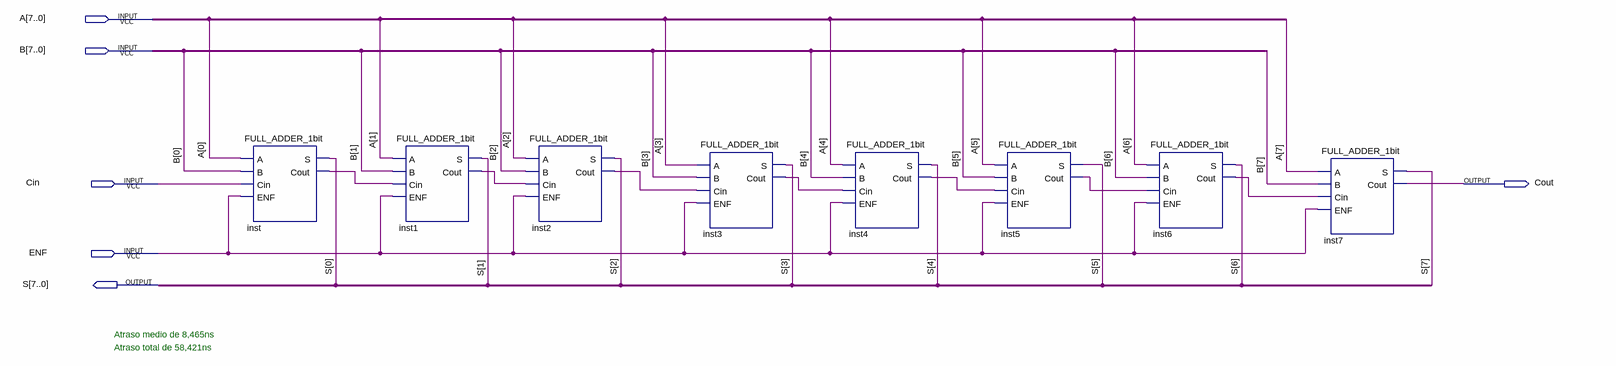
[diagram p0: schematic sheet]
// Quartus schematic FULL_ADDER_8bit.bdf as structural Verilog: 8 symbols, 6 pins
module FULL_ADDER_8bit (
  input  [7:0] A,
  input  [7:0] B,
  input  Cin,
  input  ENF,
  output Cout,
  output [7:0] S
);

  wire inst1_cout, inst2_cout, inst3_cout, inst4_cout, inst5_cout, inst6_cout, inst_cout;

  FULL_ADDER_1bit inst (.A(A[0]), .B(B[0]), .Cin(Cin), .ENF(ENF), .S(S[0]), .Cout(inst_cout));
  FULL_ADDER_1bit inst1 (.A(A[1]), .B(B[1]), .Cin(inst_cout), .ENF(ENF), .S(S[1]), .Cout(inst1_cout));
  FULL_ADDER_1bit inst2 (.A(A[2]), .B(B[2]), .Cin(inst1_cout), .ENF(ENF), .S(S[2]), .Cout(inst2_cout));
  FULL_ADDER_1bit inst3 (.A(A[3]), .B(B[3]), .Cin(inst2_cout), .ENF(ENF), .S(S[3]), .Cout(inst3_cout));
  FULL_ADDER_1bit inst4 (.A(A[4]), .B(B[4]), .Cin(inst3_cout), .ENF(ENF), .S(S[4]), .Cout(inst4_cout));
  FULL_ADDER_1bit inst5 (.A(A[5]), .B(B[5]), .Cin(inst4_cout), .ENF(ENF), .S(S[5]), .Cout(inst5_cout));
  FULL_ADDER_1bit inst6 (.A(A[6]), .B(B[6]), .Cin(inst5_cout), .ENF(ENF), .S(S[6]), .Cout(inst6_cout));
  FULL_ADDER_1bit inst7 (.A(A[7]), .B(B[7]), .Cin(inst6_cout), .ENF(ENF), .S(S[7]), .Cout(Cout));

  // Notes on the sheet:
  //   Atraso medio de 8,465ns
  //   Atraso total de 58,421ns
endmodule
